# Altium schematic sheet TL1963A SCH.schdoc
size 49 x 35 mm
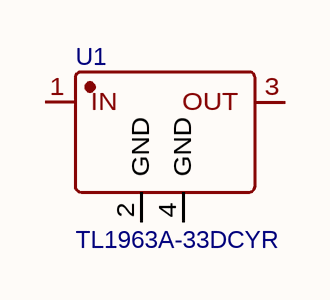
[diagram p0: TL1963A SCH.schdoc]

## Parts
U1  TL1963A-33DCYR  [SOT-223_L6.5-W3.5-P2.30-LS7.0-BR]

## Nets

Not connected (* = marked no-connect by the designer): U1 1(IN) 2(GND) 3(OUT) 4(GND)

## Library data of the parts
U1 = TL1963A-33DCYR: IC REG LIN 3.3V 1.5A SOT-223-4; Manufacturer: TI(德州仪器); Contributor: LCSC; Supplier: LCSC; Manufacturer Part: TL1963A-33DCYR; Supplier Part: C181262; JLCPCB Part Class: Extended Part; spicePre: U; spiceSymbolName: TL1963A-33DCYR; LCSC Part Number: C181262